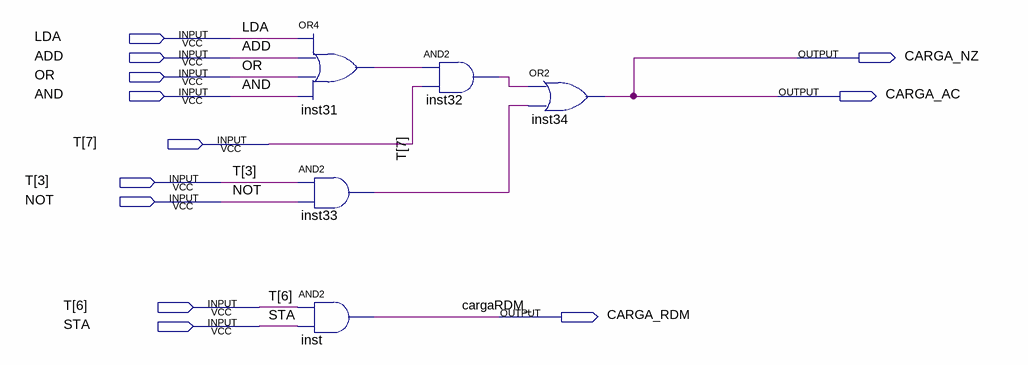
[diagram p0: schematic sheet]
// Quartus schematic UNIDADE_CONTROLE_CARGAS_AC_NZ_RDM.bdf as structural Verilog: 5 symbols, 12 pins
module UNIDADE_CONTROLE_CARGAS_AC_NZ_RDM (
  input  LDA,
  input  ADD,
  input  OR,
  input  AND,
  input  [7:3] T,
  input  NOT,
  input  STA,
  output CARGA_NZ,
  output CARGA_AC,
  output CARGA_RDM
);

  wire inst31_out, inst32_out, inst33_out;

  or inst31 (inst31_out, LDA, ADD, OR, AND);
  and inst33 (inst33_out, T[3], NOT);
  and inst (CARGA_RDM, T[6], STA);
  and inst32 (inst32_out, inst31_out, T[7]);
  or inst34 (CARGA_AC, inst32_out, inst33_out);

  assign CARGA_NZ = CARGA_AC;

  // Other names for the same wires on the sheet: cargaRDM_ = CARGA_RDM
endmodule
